# Altium schematic sheet MicroD_MEC5_Adapter.SchDoc
size 594 x 420 mm
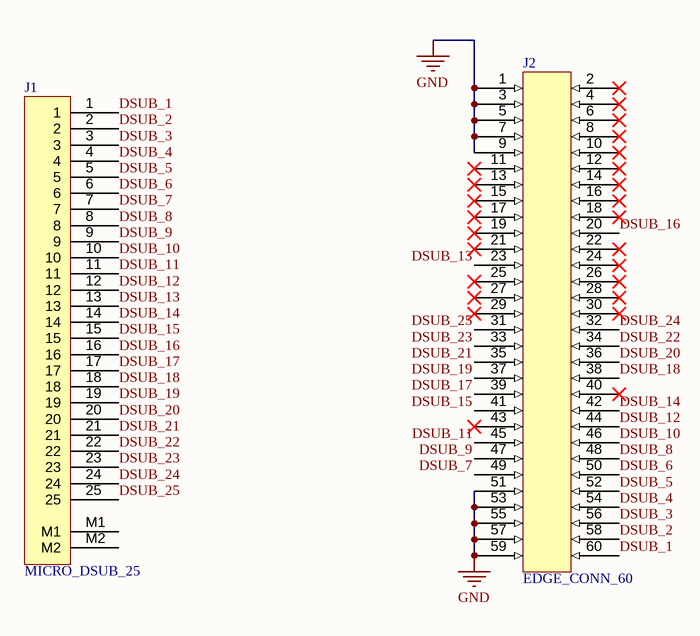
[diagram p0: MicroD_MEC5_Adapter.SchDoc]

## Parts
J1  MICRO_DSUB_25  [581-M25-213L461]
J2  EDGE_CONN_60  [EDGE_CONN_60]

## Nets
GND: J2.1 J2.3 J2.5 J2.7 J2.9 J2.51 J2.53 J2.55 J2.57 J2.59
DSUB_1: J1.1 J2.60
DSUB_2: J1.2 J2.58
DSUB_3: J1.3 J2.56
DSUB_4: J1.4 J2.54
DSUB_5: J1.5 J2.52
DSUB_6: J1.6 J2.50
DSUB_7: J1.7 J2.49
DSUB_8: J1.8 J2.48
DSUB_9: J1.9 J2.47
DSUB_10: J1.10 J2.46
DSUB_11: J1.11 J2.45
DSUB_12: J1.12 J2.44
DSUB_13: J1.13 J2.23
DSUB_14: J1.14 J2.42
DSUB_15: J1.15 J2.41
DSUB_16: J1.16 J2.20
DSUB_17: J1.17 J2.39
DSUB_18: J1.18 J2.38
DSUB_19: J1.19 J2.37
DSUB_20: J1.20 J2.36
DSUB_21: J1.21 J2.35
DSUB_22: J1.22 J2.34
DSUB_23: J1.23 J2.33
DSUB_24: J1.24 J2.32
DSUB_25: J1.25 J2.31

Not connected (* = marked no-connect by the designer): J1 M1 M2; J2 2* 4* 6* 8* 10* 11* 12* 13* 14* 15* 16* 17* 18* 19* 21* 22* 24* 25* 26* 27* 28* 29* 30* 40* 43*

## Notes on the sheet
- 10
- 9
- 8
- 7
- 6
- 5
- 4
- 3
- DWG. NO.
- 2
- 1
- THIS DOCUMENT AND THE DATA DISCLOSED HEREIN OR HEREWITH IS THE PROPERTY OF ALTIUM LIMITED AND MAY BE FREELY DISTRIBUTED IN WHOLE. NO RIGHTS ARE RESERVED OR EXPRESS OR IMPLIED WARANTEE GIVEN.
- REV.
- SHT.
- REVISION
- DESCRIPTION
- DATE
- APPROVED
- H
- G
- F
- E
- D
- C
- B
- ENG:
- DSN:
- APPROVALS
- PROJECT
- DOCUMENT REVISION:
- DESIGN ITEM:
- A
- CHK:
- BOM:
- REFERENCE DOCUMENTS
- PROJECT REVISION:
- TITLE
- FAB DWG:
- PCB DWG:
- ASSY DWG:
- SCALE:
- A2
- SIZE
- CAGE CODE
- FILE NAME
- DWG NO.
- SHEET
- OF
- REV

## Library data of the parts
J1 = MICRO_DSUB_25: Micro D-Sub 25 pin connector
J2 = EDGE_CONN_60: Card edge connector 60-pin